# Altium project VESC_DEVICE.PrjPcb
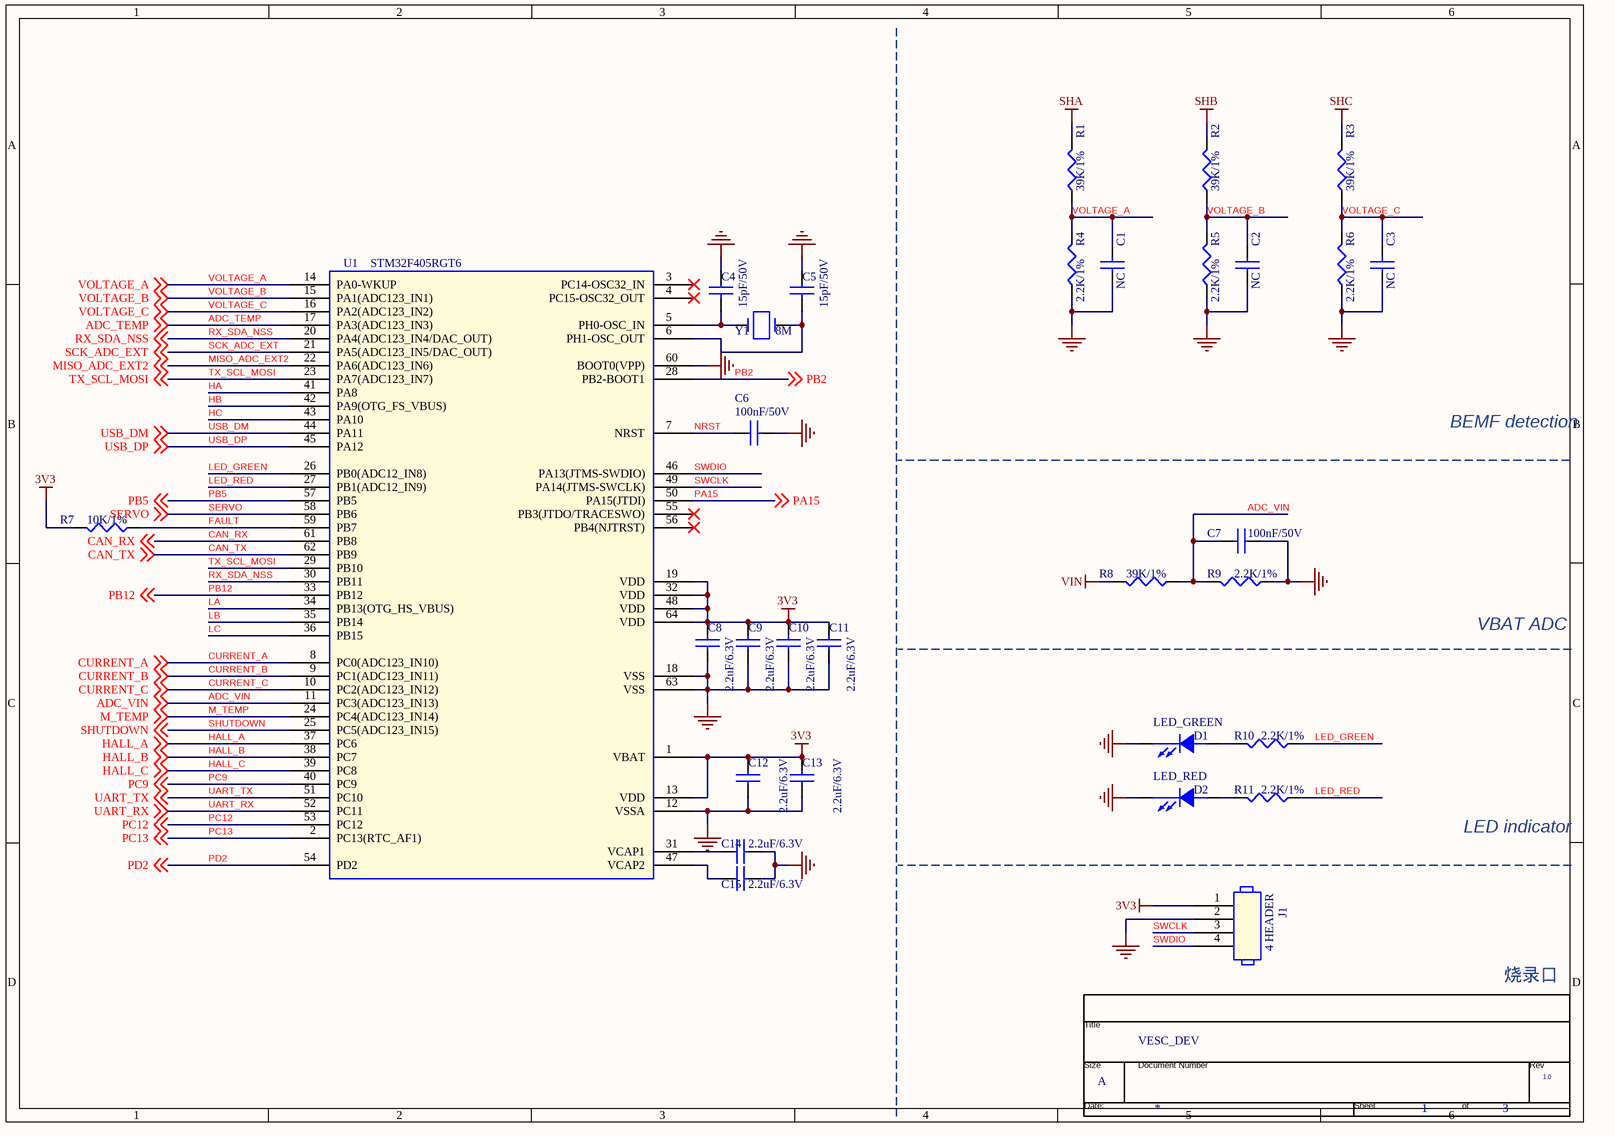
[diagram p0: PAGE1.SchDoc]
3 sheets, 120 parts. Net scope: global (net labels, ports and power ports of the same name join across sheets).
Board file: VESC_DEVICE.PcbDoc
Sheets:
  PAGE1.SchDoc
  PAGE2.SchDoc
  PAGE3.SchDoc

## Sheet PAGE1.SchDoc
size 297 x 209 mm

### Parts
(Parts that share a designator on the sheet are numbered #1, #2 ... from top to bottom, then left to right.)
*#1  Page Count: 3  Page Number: 1  Page Size: A  Title: VESC_DEV  RevCode: 1.0  (hidden comment: TitleBlock0)  (graphical)
C1  NC  [C0402]
C2  NC  [C0402]
C3  NC  [C0402]
C4  15pF/50V  [C0402]
C5  15pF/50V  [C0402]
C6  100nF/50V  [C0402]
C7  100nF/50V  [C0402]
C8  2.2uF/6.3V  [C0402]
C9  2.2uF/6.3V  [C0402]
C10  2.2uF/6.3V  [C0402]
C11  2.2uF/6.3V  [C0402]
C12  2.2uF/6.3V  [C0402]
C13  2.2uF/6.3V  [C0402]
C14  2.2uF/6.3V  [C0402]
C15  2.2uF/6.3V  [C0402]
D1  LED_GREEN  [LED0603]
D2  LED_RED  [LED0603]
J1  4 HEADER  [ISP-4P-2_54]
R1  39K/1%  [R0402]
R2  39K/1%  [R0402]
R3  39K/1%  [R0402]
R4  2.2K/1%  [R0402]
R5  2.2K/1%  [R0402]
R6  2.2K/1%  [R0402]
R7  10K/1%  [R0402]
R8  39K/1%  [R0402]
R9  2.2K/1%  [R0402]
R10  2.2K/1%  [R0402]
R11  2.2K/1%  [R0402]
U1  STM32F405RGT6  [LQFP64_10X10_05P]
Y1  8M  [SMD5032-2P]

### Nets
3V3: C8.2 C9.2 C10.2 C11.2 C12.2 C13.2 J1.1 R7.2 U1.1(VBAT) U1.13(VDD) U1.19(VDD) U1.32(VDD) U1.48(VDD) U1.64(VDD)
GND: C1.1 C2.1 C3.1 C4.1 C5.1 C6.2 C7.1 C8.1 C9.1 C10.1 C11.1 C12.1 C13.1 C14.2 C15.2 D1.1(CATHODE) D2.1(CATHODE) J1.2 R4.1 R5.1 R6.1 R9.1 U1.12(VSSA) U1.18(VSS) U1.60(BOOT0(VPP)) U1.63(VSS)
SHA: R1.2
SHB: R2.2
SHC: R3.2
VIN: R8.2
ADC_TEMP: U1.17(PA3(ADC123_IN3)) ; off-sheet ADC_TEMP
ADC_VIN: C7.2 R8.1 R9.2 U1.11(PC3(ADC123_IN13)) ; off-sheet ADC_VIN
CAN_RX: U1.61(PB8) ; off-sheet CAN_RX
CAN_TX: U1.62(PB9) ; off-sheet CAN_TX
CURRENT_A: U1.8(PC0(ADC123_IN10)) ; off-sheet CURRENT_A
CURRENT_B: U1.9(PC1(ADC123_IN11)) ; off-sheet CURRENT_B
CURRENT_C: U1.10(PC2(ADC123_IN12)) ; off-sheet CURRENT_C
FAULT: R7.1 U1.59(PB7)
HA: U1.41(PA8)
HALL_A: U1.37(PC6) ; off-sheet HALL_A
HALL_B: U1.38(PC7) ; off-sheet HALL_B
HALL_C: U1.39(PC8) ; off-sheet HALL_C
HB: U1.42(PA9(OTG_FS_VBUS))
HC: U1.43(PA10)
LA: U1.34(PB13(OTG_HS_VBUS))
LB: U1.35(PB14)
LC: U1.36(PB15)
LED_GREEN: R10.1 U1.26(PB0(ADC12_IN8))
LED_RED: R11.1 U1.27(PB1(ADC12_IN9))
M_TEMP: U1.24(PC4(ADC123_IN14)) ; off-sheet M_TEMP
MISO_ADC_EXT2: U1.22(PA6(ADC123_IN6)) ; off-sheet MISO_ADC_EXT2
NRST: C6.1 U1.7(NRST)
PA15: U1.50(PA15(JTDI)) ; off-sheet PA15
PB2: U1.28(PB2-BOOT1) ; off-sheet PB2
PB5: U1.57(PB5) ; off-sheet PB5
PB12: U1.33(PB12) ; off-sheet PB12
PC9: U1.40(PC9) ; off-sheet PC9
PC12: U1.53(PC12) ; off-sheet PC12
PC13: U1.2(PC13(RTC_AF1)) ; off-sheet PC13
PD2: U1.54(PD2) ; off-sheet PD2
RX_SDA_NSS: U1.20(PA4(ADC123_IN4/DAC_OUT)) U1.30(PB11) ; off-sheet RX_SDA_NSS
SCK_ADC_EXT: U1.21(PA5(ADC123_IN5/DAC_OUT)) ; off-sheet SCK_ADC_EXT
SERVO: U1.58(PB6) ; off-sheet SERVO
SHUTDOWN: U1.25(PC5(ADC123_IN15)) ; off-sheet SHUTDOWN
SWCLK: J1.3 U1.49(PA14(JTMS-SWCLK))
SWDIO: J1.4 U1.46(PA13(JTMS-SWDIO))
TX_SCL_MOSI: U1.23(PA7(ADC123_IN7)) U1.29(PB10) ; off-sheet TX_SCL_MOSI
UART_RX: U1.52(PC11) ; off-sheet UART_RX
UART_TX: U1.51(PC10) ; off-sheet UART_TX
USB_DM: U1.44(PA11) ; off-sheet USB_DM
USB_DP: U1.45(PA12) ; off-sheet USB_DP
VOLTAGE_A: C1.2 R1.1 R4.2 U1.14(PA0-WKUP) ; off-sheet VOLTAGE_A
VOLTAGE_B: C2.2 R2.1 R5.2 U1.15(PA1(ADC123_IN1)) ; off-sheet VOLTAGE_B
VOLTAGE_C: C3.2 R3.1 R6.2 U1.16(PA2(ADC123_IN2)) ; off-sheet VOLTAGE_C
NetC4_2: C4.2 U1.5(PH0-OSC_IN) Y1.2
NetC5_2: C5.2 U1.6(PH1-OSC_OUT) Y1.1
NetC14_1: C14.1 U1.31(VCAP1)
NetC15_1: C15.1 U1.47(VCAP2)
NetD1_2: D1.2(ANODE) R10.2
NetD2_2: D2.2(ANODE) R11.2

Not connected (* = marked no-connect by the designer): U1 3(PC14-OSC32_IN)* 4(PC15-OSC32_OUT)* 55(PB3(JTDO/TRACESWO))* 56(PB4(NJTRST))*

### Notes on the sheet
- BEMF detection
- VBAT ADC
- LED indicator
- 烧录口
- (in symbol TitleBlock0) Title; Size; Document Number; Rev; Date:; Sheet; of

### Library data of the parts
C1-C15 = CAP NP: PCB Footprint: C0402
D1 D2 = LED: PCB Footprint: LED0603
R1-R11 = RESISTOR: PCB Footprint: R0402
Y1 = CRYSTAL: PCB Footprint: SMD5032-2P
*#1 = TitleBlock0: Page Create Date: March  8, 1995; Page Modify Date: *
J1 = 4 HEADER: PCB Footprint: ISP-4P-2_54
U1 = STM32F405RGT6: PCB Footprint: LQFP64_10X10_05P

## Sheet PAGE2.SchDoc
size 297 x 209 mm
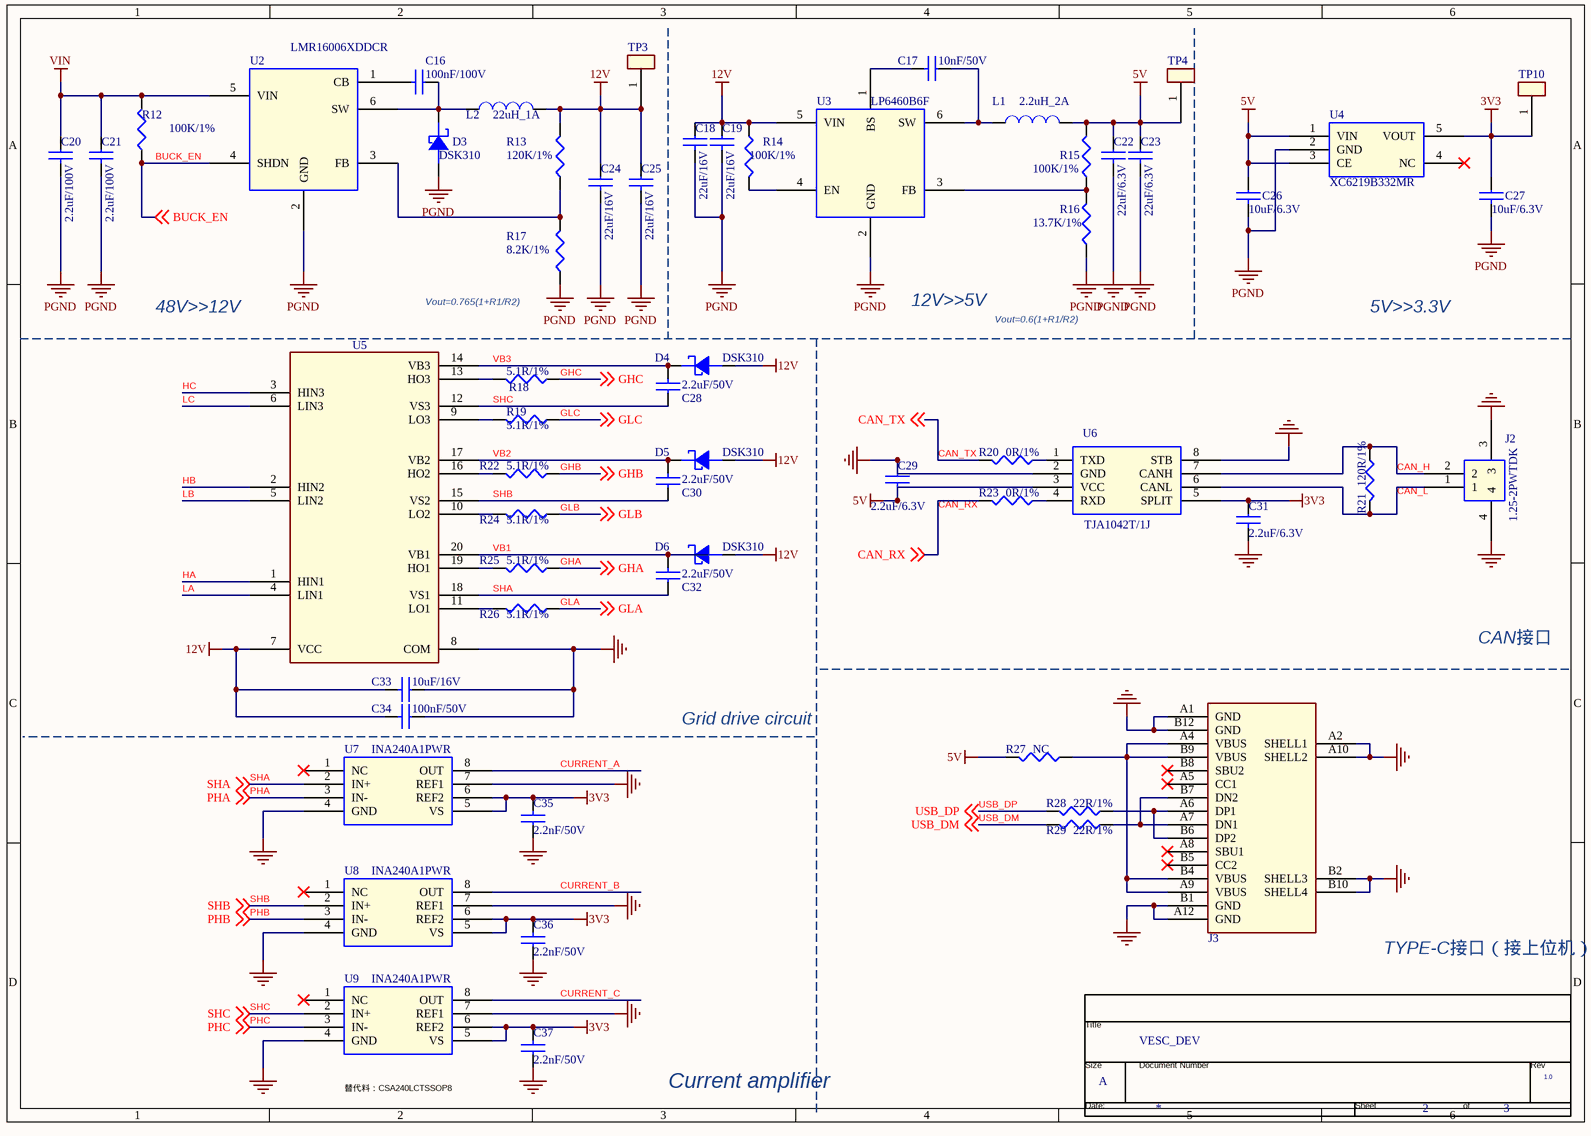
[diagram p1: PAGE2.SchDoc]

### Parts
(Parts that share a designator on the sheet are numbered #1, #2 ... from top to bottom, then left to right.)
*#2  Page Count: 3  Page Number: 2  Page Size: A  Title: VESC_DEV  RevCode: 1.0  (hidden comment: TitleBlock0)  (graphical)
C16  100nF/100V  [C0603]
C17  10nF/50V  [C0402]
C18  22uF/16V  [C0805]
C19  22uF/16V  [C0805]
C20  2.2uF/100V  [C1206]
C21  2.2uF/100V  [C1206]
C22  22uF/6.3V  [C0805]
C23  22uF/6.3V  [C0805]
C24  22uF/16V  [C0805]
C25  22uF/16V  [C0805]
C26  10uF/6.3V  [C0402]
C27  10uF/6.3V  [C0402]
C28  2.2uF/50V  [C0603]
C29  2.2uF/6.3V  [C0402]
C30  2.2uF/50V  [C0603]
C31  2.2uF/6.3V  [C0402]
C32  2.2uF/50V  [C0603]
C33  10uF/16V  [C0603]
C34  100nF/50V  [C0402]
C35  2.2nF/50V  [C0402]
C36  2.2nF/50V  [C0402]
C37  2.2nF/50V  [C0402]
D3  DSK310  [SOD-123F]
D4  DSK310  [SOD-123F]
D5  DSK310  [SOD-123F]
D6  DSK310  [SOD-123F]
J2  1.25-2PWTDK  [SMD-2P-1_25]
J3  TYPE-C 16PLC-H10.0  [TYPE-C-TH_16PLC-H10.0]  (value not drawn)
L1  2.2uH_2A  [L4020]
L2  22uH_1A  [L4020]
R12  100K/1%  [R0402]
R13  120K/1%  [R0402]
R14  100K/1%  [R0402]
R15  100K/1%  [R0402]
R16  13.7K/1%  [R0402]
R17  8.2K/1%  [R0402]
R18  5.1R/1%  [R0402]
R19  5.1R/1%  [R0402]
R20  0R/1%  [R0402]
R21  120R/1%  [R0402]
R22  5.1R/1%  [R0402]
R23  0R/1%  [R0402]
R24  5.1R/1%  [R0402]
R25  5.1R/1%  [R0402]
R26  5.1R/1%  [R0402]
R27  NC  [R0603]
R28  22R/1%  [R0402]
R29  22R/1%  [R0402]
TP3  TEST POINT  [test_point_100_smd]  (value not drawn)
TP4  TEST POINT  [test_point_100_smd]  (value not drawn)
TP10  TEST POINT  [test_point_100_smd]  (value not drawn)
U2  LMR16006XDDCR  [SOT-23-6]
U3  LP6460B6F  [SOT-23-6]
U4  XC6219B332MR  [SOT-23-5]
U5  FD6288T  [TSSOP-20]  (value not drawn)
U6  TJA1042T/1J  [SOP-8]
U7  INA240A1PWR  [TSSOP-8]
U8  INA240A1PWR  [TSSOP-8]
U9  INA240A1PWR  [TSSOP-8]

### Nets
3V3: C27.1 C31.1 C35.2 C36.2 C37.2 TP10.1 U4.5(VOUT) U6.5(SPLIT) U7.5(VS) U7.6(REF2) U8.5(VS) U8.6(REF2) U9.5(VS) U9.6(REF2)
5V: C22.1 C23.1 C26.1 C29.2 L1.2 R15.2 R27.2 TP4.1 U4.1(VIN) U4.3(CE) U6.3(VCC)
12V: C18.1 C19.1 C24.1 C25.1 C33.2 C34.2 D4.2(A) D5.2(A) D6.2(A) L2.2 R13.2 R14.1 TP3.1 U3.5(VIN) U5.7(VCC)
GND: C29.1 C31.2 C33.1 C34.1 C35.1 C36.1 C37.1 J2.3 J2.4 J3.A1(GND) J3.A2(SHELL1) J3.A10(SHELL2) J3.A12(GND) J3.B1(GND) J3.B2(SHELL3) J3.B10(SHELL4) J3.B12(GND) U5.8(COM) U6.2(GND) U6.8(STB) U7.4(GND) U7.7(REF1) U8.4(GND) U8.7(REF1) U9.4(GND) U9.7(REF1)
PGND: C18.2 C19.2 C20.2 C21.2 C22.2 C23.2 C24.2 C25.2 C26.2 C27.2 D3.2(A) R16.1 R17.1 U2.2(GND) U3.2(GND) U4.2(GND)
SHA: C32.1 U5.18(VS1) U7.2(IN+) ; off-sheet SHA
SHB: C30.1 U5.15(VS2) U8.2(IN+) ; off-sheet SHB
SHC: C28.1 U5.12(VS3) U9.2(IN+) ; off-sheet SHC
VIN: C20.1 C21.1 R12.2 U2.5(VIN)
BUCK_EN: R12.1 U2.4(SHDN) ; off-sheet BUCK_EN
CAN_H: J2.2 R21.1 U6.7(CANH)
CAN_L: J2.1 R21.2 U6.6(CANL)
CAN_RX: R23.2 ; off-sheet CAN_RX
CAN_TX: R20.2 ; off-sheet CAN_TX
CURRENT_A: U7.8(OUT)
CURRENT_B: U8.8(OUT)
CURRENT_C: U9.8(OUT)
GHA: R25.1 ; off-sheet GHA
GHB: R22.1 ; off-sheet GHB
GHC: R18.1 ; off-sheet GHC
GLA: R26.1 ; off-sheet GLA
GLB: R24.1 ; off-sheet GLB
GLC: R19.1 ; off-sheet GLC
HA: U5.1(HIN1)
HB: U5.2(HIN2)
HC: U5.3(HIN3)
LA: U5.4(LIN1)
LB: U5.5(LIN2)
LC: U5.6(LIN3)
PHA: U7.3(IN-) ; off-sheet PHA
PHB: U8.3(IN-) ; off-sheet PHB
PHC: U9.3(IN-) ; off-sheet PHC
USB_DM: R29.2 ; off-sheet USB_DM
USB_DP: R28.2 ; off-sheet USB_DP
VB1: C32.2 D6.1(K) U5.20(VB1)
VB2: C30.2 D5.1(K) U5.17(VB2)
VB3: C28.2 D4.1(K) U5.14(VB3)
NetC16_1: C16.1 D3.1(K) L2.1 U2.6(SW)
NetC16_2: C16.2 U2.1(CB)
NetC17_1: C17.1 L1.1 U3.6(SW)
NetC17_2: C17.2 U3.1(BS)
NetJ3_A4: J3.A4(VBUS) J3.A9(VBUS) J3.B4(VBUS) J3.B9(VBUS) R27.1
NetJ3_A6: J3.A6(DP1) J3.B6(DP2) R28.1
NetJ3_A7: J3.A7(DN1) J3.B7(DN2) R29.1
NetR13_1: R13.1 R17.2 U2.3(FB)
NetR14_2: R14.2 U3.4(EN)
NetR15_1: R15.1 R16.2 U3.3(FB)
NetR18_2: R18.2 U5.13(HO3)
NetR19_2: R19.2 U5.9(LO3)
NetR20_1: R20.1 U6.1(TXD)
NetR22_2: R22.2 U5.16(HO2)
NetR23_1: R23.1 U6.4(RXD)
NetR24_2: R24.2 U5.10(LO2)
NetR25_2: R25.2 U5.19(HO1)
NetR26_2: R26.2 U5.11(LO1)

Not connected (* = marked no-connect by the designer): J3 A5(CC1)* A8(SBU1)* B5(CC2)* B8(SBU2)*; U4 4(NC)*; U7 1(NC)*; U8 1(NC)*; U9 1(NC)*

### Notes on the sheet
- 48V>>12V
- Vout=0.765(1+R1/R2)
- 12V>>5V
- Vout=0.6(1+R1/R2)
- 5V>>3.3V
- CAN接口
- Grid drive circuit
- TYPE-C接口（接上位机）
- (near U9) 替代料：CSA240LCTSSOP8
- Current amplifier
- (in symbol TitleBlock0) Title; Size; Document Number; Rev; Date:; Sheet; of

### Library data of the parts
C16-C37 = CAP NP
  C16 C28 C30 C32 C33: PCB Footprint: C0603
  C17 C26 C27 C29 C31 C34-C37: PCB Footprint: C0402
  C18 C19 C22-C25: PCB Footprint: C0805
  C20 C21: PCB Footprint: C1206
D3-D6 = DIODE SCHOTTKY21: PCB Footprint: SOD-123F
J3 = TYPE-C 16PLC-H10.0: 连接器类型:Type-C;标准:USB 3.1;公母:母;安装方式:直插;触点数量:16P;端口数量:1;额定电流 - 电源:5A;触头材质:-;触头镀层:-;工作温度范围:-40℃~+85℃;; Manufacturer: SHOU HAN(首韩); Add into BOM: yes; Gender: 母; Number of Contacts: 16P; Number of Ports: 1; Current Rating - Power (Max): 5A; Rated Voltage (Max): 20V; Connect-Disconnect Life: 1万次; Core Colour: 黑色; Symbol: TYPE-C 16PLC-H10.0; Device: TYPE-C 16PLC-H10.0; LCSC Part Name: Type-C 母 直插; Supplier Part: C3151747; Manufacturer Part: TYPE-C 16PLC-H10.0; Supplier Footprint: 插件; Datasheet: https://atta.szlcsc.com/upload/public/pdf/source/20240529/CC9428849977884A813B584EA396EFE9.pdf; Supplier: LCSC; Convert to PCB: yes; Connector Type: Type-C; Standard: USB 3.1; Mounting Style: 直插; Contact Material: -; Contact Plating: -; Operating Temperature Range: -40℃~+85℃
L1 L2 = INDUCTOR: PCB Footprint: L4020
R12-R29 = RESISTOR
  R12-R26 R28 R29: PCB Footprint: R0402
  R27: PCB Footprint: R0603
*#2 = TitleBlock0: Page Create Date: March  8, 1995; Page Modify Date: *
J2 = 1.25-2PWTDK: PCB Footprint: SMD-2P-1_25
U2 = LMR16006XDDCR: PCB Footprint: SOT-23-6
U3 = LP6460B6F: PCB Footprint: SOT-23-6
U4 = XC6219B332MR: PCB Footprint: SOT-23-5
U6 = TJA1042T/1J: PCB Footprint: SOP-8
U7-U9 = INA240A1PWR: PCB Footprint: TSSOP-8

## Sheet PAGE3.SchDoc
size 246 x 182 mm
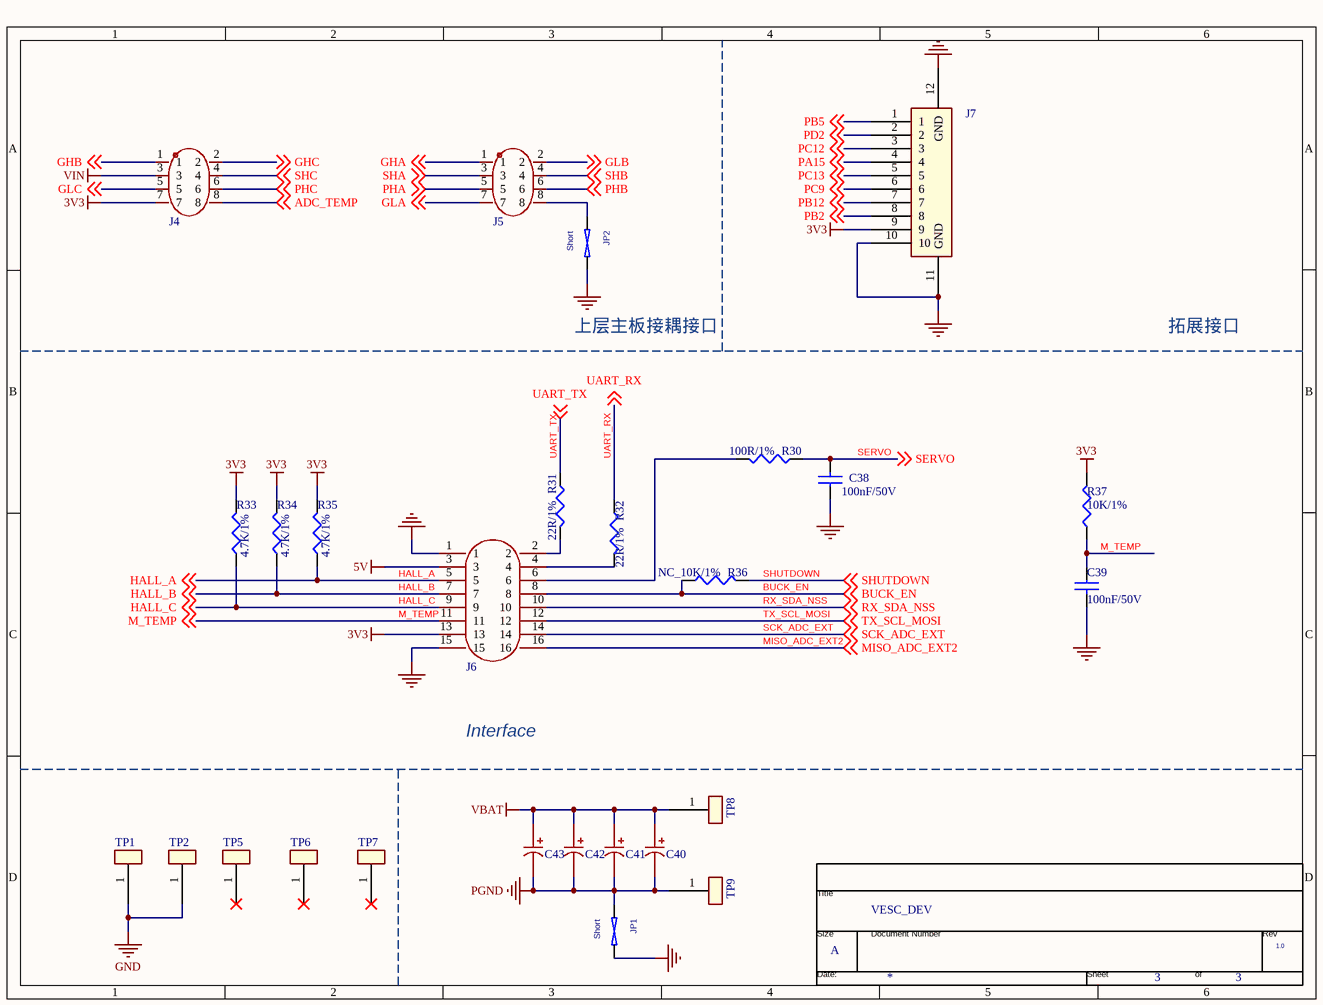
[diagram p2: PAGE3.SchDoc]

### Parts
(Parts that share a designator on the sheet are numbered #1, #2 ... from top to bottom, then left to right.)
*#3  Page Count: 3  Page Size: A  Title: VESC_DEV  RevCode: 1.0  (hidden comment: TitleBlock0)  (graphical)
C38  100nF/50V  [C0402]
C39  100nF/50V  [C0402]
C40  680uF  [CAP-TH_BD10.0-P5.00-D0.6-FD]  (value not drawn)
C41  680uF  [CAP-TH_BD10.0-P5.00-D0.6-FD]  (value not drawn)
C42  680uF  [CAP-TH_BD10.0-P5.00-D0.6-FD]  (value not drawn)
C43  680uF  [CAP-TH_BD10.0-P5.00-D0.6-FD]  (value not drawn)
J4  X6521WVS-2x04H-C60D74  [HDR-SMD_8P-P1.27-V-M-C2-C4-LS5.3]  (value not drawn)
J5  X6521WVS-2x04H-C60D74  [HDR-SMD_8P-P1.27-V-M-C2-C4-LS5.3]  (value not drawn)
J6  HC-5557-2*8A  [CONN-TH_HC5557-2X8A]  (value not drawn)
J7  1.25-10GH_1  [CONN-SMD_10P-P1.25_JS_GH125-S10CCA-00]  (value not drawn)
JP1  Short  [SHORT]
JP2  Short  [SHORT]
R30  100R/1%  [R0402]
R31  22R/1%  [R0402]
R32  22R/1%  [R0402]
R33  4.7K/1%  [R0402]
R34  4.7K/1%  [R0402]
R35  4.7K/1%  [R0402]
R36  NC_10K/1%  [R0402]
R37  10K/1%  [R0402]
TP1  TEST POINT  [HOLE-4MM_M]  (value not drawn)
TP2  TEST POINT  [HOLE-4MM_M]  (value not drawn)
TP5  TEST POINT  [HOLE-8MM_M]  (value not drawn)
TP6  TEST POINT  [HOLE-8MM_M]  (value not drawn)
TP7  TEST POINT  [HOLE-8MM_M]  (value not drawn)
TP8  TEST POINT  [HOLE-8MM_M]  (value not drawn)
TP9  TEST POINT  [HOLE-8MM_M]  (value not drawn)

### Nets
3V3: J4.7 J6.13 J7.9 R33.2 R34.2 R35.2 R37.2
5V: J6.3
GND: C38.1 C39.2 J6.1 J6.15 J7.10 J7.11(GND) J7.12(GND) JP1.2 JP2.2 TP1.1 TP2.1
PGND: C40.2 C41.2 C42.2 C43.2 JP1.1 TP9.1
SHA: J5.3 ; off-sheet SHA
SHB: J5.4 ; off-sheet SHB
SHC: J4.4 ; off-sheet SHC
VBAT: C40.1 C41.1 C42.1 C43.1 TP8.1
VIN: J4.3
ADC_TEMP: J4.8 ; off-sheet ADC_TEMP
BUCK_EN: J6.8 R36.2 ; off-sheet BUCK_EN
GHA: J5.1 ; off-sheet GHA
GHB: J4.1 ; off-sheet GHB
GHC: J4.2 ; off-sheet GHC
GLA: J5.7 ; off-sheet GLA
GLB: J5.2 ; off-sheet GLB
GLC: J4.5 ; off-sheet GLC
HALL_A: J6.5 R35.1 ; off-sheet HALL_A
HALL_B: J6.7 R34.1 ; off-sheet HALL_B
HALL_C: J6.9 R33.1 ; off-sheet HALL_C
M_TEMP: C39.1 J6.11 R37.1 ; off-sheet M_TEMP
MISO_ADC_EXT2: J6.16 ; off-sheet MISO_ADC_EXT2
PA15: J7.4 ; off-sheet PA15
PB2: J7.8 ; off-sheet PB2
PB5: J7.1 ; off-sheet PB5
PB12: J7.7 ; off-sheet PB12
PC9: J7.6 ; off-sheet PC9
PC12: J7.3 ; off-sheet PC12
PC13: J7.5 ; off-sheet PC13
PD2: J7.2 ; off-sheet PD2
PHA: J5.5 ; off-sheet PHA
PHB: J5.6 ; off-sheet PHB
PHC: J4.6 ; off-sheet PHC
RX_SDA_NSS: J6.10 ; off-sheet RX_SDA_NSS
SCK_ADC_EXT: J6.14 ; off-sheet SCK_ADC_EXT
SERVO: C38.2 R30.2 ; off-sheet SERVO
SHUTDOWN: R36.1 ; off-sheet SHUTDOWN
TX_SCL_MOSI: J6.12 ; off-sheet TX_SCL_MOSI
UART_RX: R32.2 ; off-sheet UART_RX
UART_TX: R31.2 ; off-sheet UART_TX
NetJ5_8: J5.8 JP2.1
NetJ6_2: J6.2 R31.1
NetJ6_4: J6.4 R32.1
NetJ6_6: J6.6 R30.1

Not connected (* = marked no-connect by the designer): TP5 1*; TP6 1*; TP7 1*

### Notes on the sheet
- 上层主板接耦接口
- 拓展接口
- Interface
- (in symbol TitleBlock0) Title; Size; Document Number; Rev; Date:; Sheet; of

### Library data of the parts
C38 C39 = CAP NP: PCB Footprint: C0402
C40-C43 = ERS1VM681G16OT: 容值:680uF;精度:±20%;额定电压:35V;纹波电流:-;等效串联电阻:-;; Manufacturer: AISHI(艾华集团); Add into BOM: yes; Tolerance: ±20%; Rated Voltage: 35V; Symbol: ERS1VM681G16OT; Device: ERS1VM681G16OT; LCSC Part Name: 680uF ±20% 35V; Supplier Part: C721283; Manufacturer Part: ERS1VM681G16OT; Supplier Footprint: 插件,D10xL16mm; Datasheet: https://atta.szlcsc.com/upload/public/pdf/source/20191015/C438940_4B8E60A742BB0AE40DDEF87A5C89089D.pdf; Supplier: LCSC; Convert to PCB: yes; Value: 680uF; Ripple Current: -; Equivalent Series Resistance(ESR): -; Lead Spacing: -; φD: -; L: -; Lifetime @ Temp: -
J4 J5 = X6521WVS-2x04H-C60D74: Manufacturer: XKB Connection(中国星坤); Symbol: X6521WVS-2*04H-C60D74; Add into BOM: yes; Pin Structure: 2x4P; Pitch: 2.54mm; Circluar Pins/Square Pins: 方针; Current Rating (Max): 3A; Voltage Rating (Max): 250V; Soldering Temperature(Max): 260℃; Device: X6521WVS-2x04H-C60D74; LCSC Part Name: 2x4P 间距:2.54mm 方针; Supplier Part: C780053; Manufacturer Part: X6521WVS-2x04H-C60D74; Supplier Footprint: SMD,P=2.54mm; JLCPCB Part Class: Extended Part; Datasheet: https://atta.szlcsc.com/upload/public/pdf/source/20211009/E3239EE5247E6BAFECB8B74A4FCF9AB8.pdf; Supplier: LCSC; Convert to PCB: yes; Row Spacing: 2.54mm; Mounting Type: -; Number of Rows: 双排; Number of Pins: 8P; Length of Mating Pin: -; Insulation Height: 2.5mm; Length of End Connection Pin: -; Contact Material: 黄铜; Contact Plating: 金; Operating Temperature Range: -40℃~+105℃; Color: 黑色
J6 = HC-5557-2*8A: 插针结构:2x8P;间距:4.2mm;安装方式:直插;参考系列:Mini-Fit(MX 4.2);总PIN数:16P;排数:2;每排PIN数:8;行距:4.2mm;额定电流:9A;触头材质:黄铜;触头镀层:锡;工作温度范围:-25℃~+85℃;; Manufacturer: HCTL(华灿天禄); Add into BOM: yes; Pins Structure: 2x8P; Pitch: 4.2mm; Number of PINs Per Row: 8; Current Rating (Max): 9A; Rated Voltage (Max): 600V; Plastic Material: PA66; Flame Retardant Rating: UL94V-0; Z-Height of the Board: 13.1mm; X-Length of Bottom Edge on Board (Spacing Line): 34.8mm; Y-Width of Bottom Edge on Board: 11.4mm; Symbol: HC-5557-2*8A; Device: HC-5557-2*8A; LCSC Part Name: 2x8P 间距:4.2mm 直插 系列:Mini-Fit(MX 4.2); Supplier Part: C2845783; Manufacturer Part: HC-5557-2*8A; Supplier Footprint: 插件,P=4.2mm; Datasheet: https://atta.szlcsc.com/upload/public/pdf/source/20230620/FF5B1F4AE343F4430EEB0EA0134778E8.pdf; Supplier: LCSC; Convert to PCB: yes; Mounting Style: 直插; Reference Series: Mini-Fit(MX 4.2); Number of Pins: 16P; Number of Rows: 2; Row Spacing: 4.2mm; Contact Material: 黄铜; Contact Plating: 锡; Operating Temperature Range: -25℃~+85℃; Supplementary Features: -; Colour: -
JP1 JP2 = SHORT: 2 PIN SHORTED TO CONNECT DIFFERENT NETS; PART_NUMBER: TMP-442; CLASS: DISCRETE
R30-R37 = RESISTOR: PCB Footprint: R0402
*#3 = TitleBlock0: Page Number: 3; Page Create Date: March  8, 1995; Page Modify Date: *

## Nets that join several sheets
3V3: PAGE1 (14 pins), PAGE2 (14 pins), PAGE3 (7 pins)
5V: PAGE2 (11 pins), PAGE3 (J6.3)
GND: PAGE1 (26 pins), PAGE2 (26 pins), PAGE3 (11 pins)
PGND: PAGE2 (16 pins), PAGE3 (6 pins)
SHA: PAGE1 (R1.2), PAGE2 (C32.1 U5.18 U7.2), PAGE3 (J5.3)
SHB: PAGE1 (R2.2), PAGE2 (C30.1 U5.15 U8.2), PAGE3 (J5.4)
SHC: PAGE1 (R3.2), PAGE2 (C28.1 U5.12 U9.2), PAGE3 (J4.4)
VIN: PAGE1 (R8.2), PAGE2 (C20.1 C21.1 R12.2 U2.5), PAGE3 (J4.3)
ADC_TEMP: PAGE1 (U1.17), PAGE3 (J4.8)
BUCK_EN: PAGE2 (R12.1 U2.4), PAGE3 (J6.8 R36.2)
CAN_RX: PAGE1 (U1.61), PAGE2 (R23.2)
CAN_TX: PAGE1 (U1.62), PAGE2 (R20.2)
CURRENT_A: PAGE1 (U1.8), PAGE2 (U7.8)
CURRENT_B: PAGE1 (U1.9), PAGE2 (U8.8)
CURRENT_C: PAGE1 (U1.10), PAGE2 (U9.8)
GHA: PAGE2 (R25.1), PAGE3 (J5.1)
GHB: PAGE2 (R22.1), PAGE3 (J4.1)
GHC: PAGE2 (R18.1), PAGE3 (J4.2)
GLA: PAGE2 (R26.1), PAGE3 (J5.7)
GLB: PAGE2 (R24.1), PAGE3 (J5.2)
GLC: PAGE2 (R19.1), PAGE3 (J4.5)
HA: PAGE1 (U1.41), PAGE2 (U5.1)
HALL_A: PAGE1 (U1.37), PAGE3 (J6.5 R35.1)
HALL_B: PAGE1 (U1.38), PAGE3 (J6.7 R34.1)
HALL_C: PAGE1 (U1.39), PAGE3 (J6.9 R33.1)
HB: PAGE1 (U1.42), PAGE2 (U5.2)
HC: PAGE1 (U1.43), PAGE2 (U5.3)
LA: PAGE1 (U1.34), PAGE2 (U5.4)
LB: PAGE1 (U1.35), PAGE2 (U5.5)
LC: PAGE1 (U1.36), PAGE2 (U5.6)
M_TEMP: PAGE1 (U1.24), PAGE3 (C39.1 J6.11 R37.1)
MISO_ADC_EXT2: PAGE1 (U1.22), PAGE3 (J6.16)
PA15: PAGE1 (U1.50), PAGE3 (J7.4)
PB2: PAGE1 (U1.28), PAGE3 (J7.8)
PB5: PAGE1 (U1.57), PAGE3 (J7.1)
PB12: PAGE1 (U1.33), PAGE3 (J7.7)
PC9: PAGE1 (U1.40), PAGE3 (J7.6)
PC12: PAGE1 (U1.53), PAGE3 (J7.3)
PC13: PAGE1 (U1.2), PAGE3 (J7.5)
PD2: PAGE1 (U1.54), PAGE3 (J7.2)
PHA: PAGE2 (U7.3), PAGE3 (J5.5)
PHB: PAGE2 (U8.3), PAGE3 (J5.6)
PHC: PAGE2 (U9.3), PAGE3 (J4.6)
RX_SDA_NSS: PAGE1 (U1.20 U1.30), PAGE3 (J6.10)
SCK_ADC_EXT: PAGE1 (U1.21), PAGE3 (J6.14)
SERVO: PAGE1 (U1.58), PAGE3 (C38.2 R30.2)
SHUTDOWN: PAGE1 (U1.25), PAGE3 (R36.1)
TX_SCL_MOSI: PAGE1 (U1.23 U1.29), PAGE3 (J6.12)
UART_RX: PAGE1 (U1.52), PAGE3 (R32.2)
UART_TX: PAGE1 (U1.51), PAGE3 (R31.2)
USB_DM: PAGE1 (U1.44), PAGE2 (R29.2)
USB_DP: PAGE1 (U1.45), PAGE2 (R28.2)